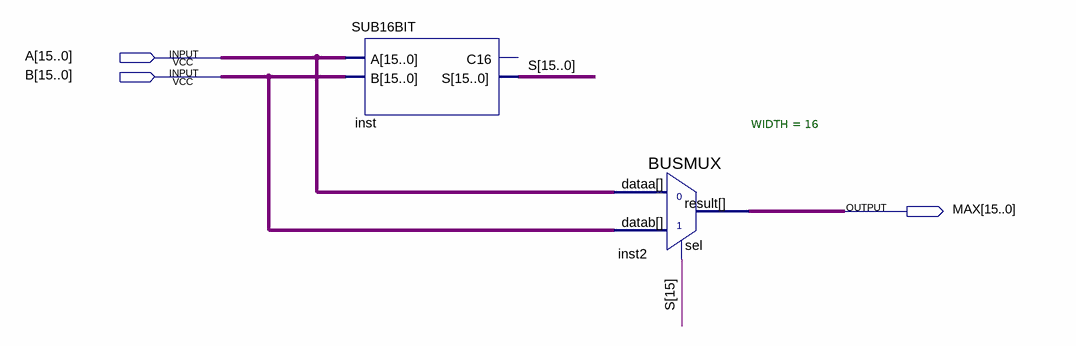
[diagram p0: schematic sheet]
// Quartus schematic MAX.bdf as structural Verilog: 2 symbols, 3 pins
module MAX (
  input  [15:0] A,
  input  [15:0] B,
  output [15:0] MAX
);

  wire [15:0] S;

  SUB16BIT inst (.A(A), .B(B), .S(S));  // open: C16
  BUSMUX #(.WIDTH(16)) inst2 (.datab(B), .sel(S[15]), .dataa(A), .result(MAX));
endmodule
